# Altium schematic sheet Charging.SchDoc
size A
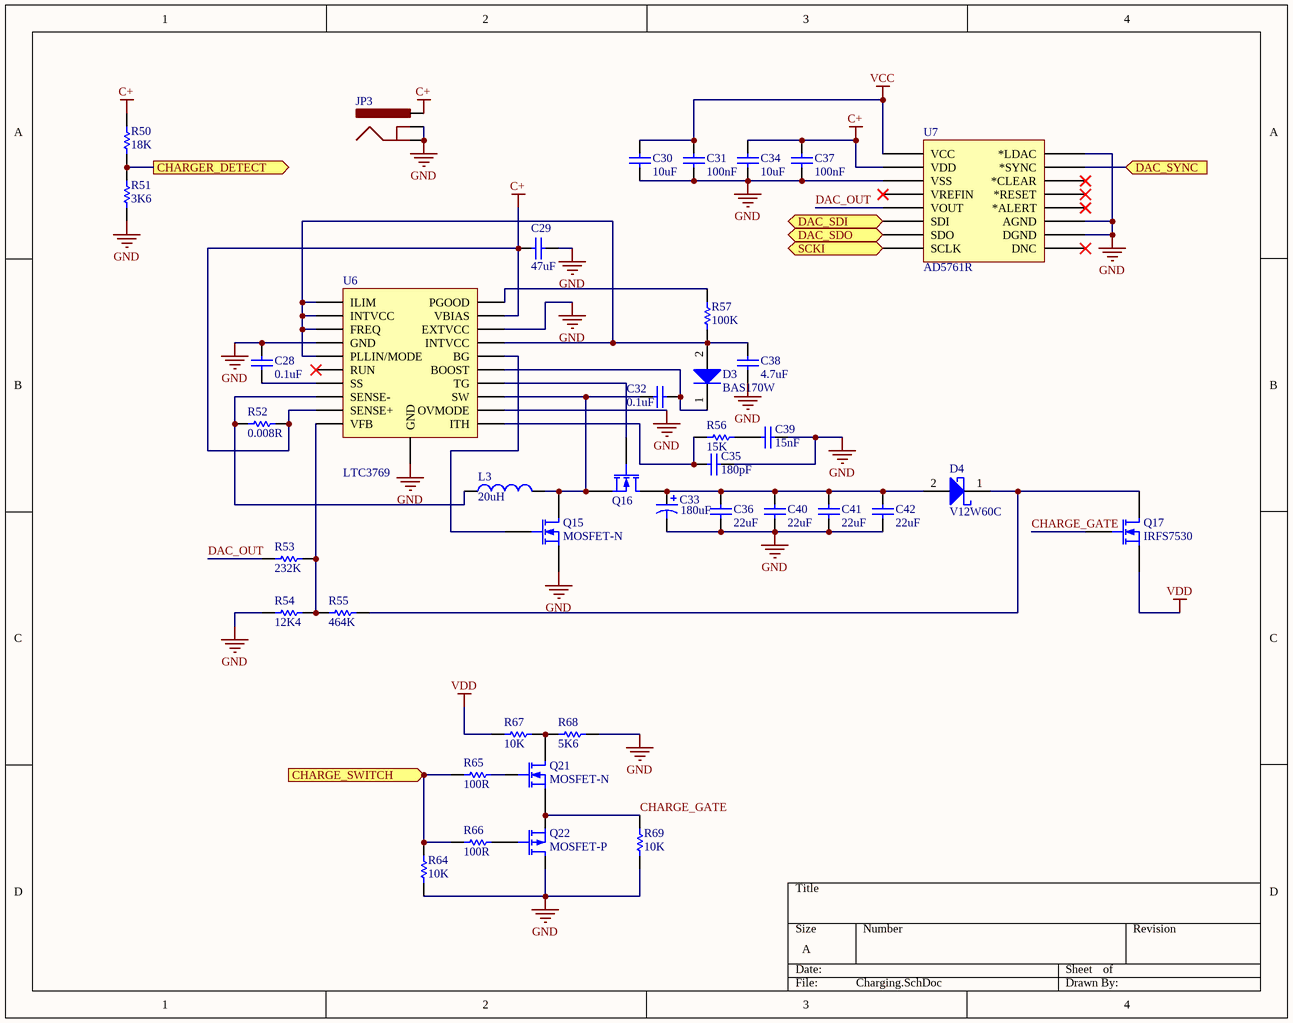
[diagram p0: Charging.SchDoc]

## Parts
C28  0.1uF  [CAPC0603(1608)100_M]
C29  47uF  [CAPC1206(3216)190_M]
C30  10uF  [CAPC0805(2012)145_N]
C31  100nF  [CAPC0603(1608)100_N]
C32  0.1uF  [CAPC0603(1608)100_M]
C33  value 180uF  [CAP 180uF 50V]
C34  10uF  [CAPC0805(2012)145_N]
C35  180pF  [CAPC0603(1608)100_M]
C36  22uF  [CAPC2220(5750)230_N]
C37  100nF  [CAPC0603(1608)100_N]
C38  4.7uF  [CAPC0603(1608)55_M]
C39  15nF  [CAPC0603(1608)100_L]
C40  22uF  [CAPC2220(5750)230_N]
C41  22uF  [CAPC2220(5750)230_N]
C42  22uF  [CAPC2220(5750)230_N]
D3  BAS170W  [INF-SOD323_V]
D4  V12W60C  [DPAK229P1003X238-3N]
JP3  (no value)  [POWER_JACK_SMD_OVERPASTE_REDBOARD_0603]
L3  value 20uH  [Inductor_LR]
Q15  MOSFET-N  [SOIC127P600X175-8N]
Q16  (no value)  [SOIC127P600X175-8N]
Q17  IRFS7530  [DPAK127P1525X483-7N]
Q21  MOSFET-N  [SOT23-3]
Q22  MOSFET-P  [SOT23-3]
R50  18K  [RESC0603(1608)_M]
R51  3K6  [RESC0603(1608)_L]
R52  0.008R  [RESC2010(5025)_L]
R53  232K  [RESC0603(1608)_N]
R54  12K4  [RESC0603(1608)_M]
R55  464K  [RESC0603(1608)_M]
R56  15K  [RESC0603(1608)_M]
R57  100K  [RESC0603(1608)_N]
R64  10K  [RESC0603(1608)_N]
R65  100R  [RESC0603(1608)_L]
R66  100R  [RESC0603(1608)_L]
R67  10K  [RESC0603(1608)_N]
R68  5K6  [RESC0603(1608)_M]
R69  10K  [RESC0603(1608)_N]
U6  LTC3769  [TSOP65P640X120_HS-21N]
U7  AD5761R  [RU_16]

## Ports
CHARGE_SWITCH (in), CHARGER_DETECT (out), DAC_SDI (in), DAC_SDO (out), DAC_SYNC (in), SCKI (in)

## Nets
C+: C29.1 C34.2 C37.2 JP3.VIN0(PWR) R50.2 R52.2 U6.9(SENSE+) U6.19(VBIAS) U7.8(VDD)
GND: C28.2 C29.2 C30.1 C31.1 C33.2 C34.1 C35.2 C36.1 C37.1 C38.1 C39.2 C40.1 C41.1 C42.1 JP3.GND(GNDBREAK) JP3.P$4(GND) Q15.3(S) Q22.2(D) R51.1 R54.1 R64.1 R68.1 R69.1 U6.4(GND) U6.12(OVMODE) U6.18(EXTVCC) U6.21(GND) U7.5(AGND) U7.6(VSS) U7.11(*LDAC) U7.16(DGND)
VCC: C30.2 C31.2 U7.15(VCC)
VDD: Q17.3(S) R67.2
CHARGE_GATE: Q17.2(G) Q21.3(S) Q22.3(S) R69.2
CHARGE_SWITCH: R64.2 R65.1 R66.1 ; port CHARGE_SWITCH
CHARGER_DETECT: R50.1 R51.2 ; port CHARGER_DETECT
DAC_OUT: R53.1 U7.7(VOUT)
DAC_SDI: U7.12(SDI) ; port DAC_SDI
DAC_SDO: U7.10(SDO) ; port DAC_SDO
DAC_SYNC: U7.13(*SYNC) ; port DAC_SYNC
SCKI: U7.14(SCLK) ; port SCKI
NetC28_1: C28.1 U6.7(SS)
NetC32_1: C32.1 L3.2 Q15.2(D) Q16.3(S) U6.13(SW)
NetC32_2: C32.2 D3.1(K) U6.15(BOOST)
NetC33_1: C33.1 C36.2 C40.2 C41.2 C42.2 D4.2(A) Q16.2(D)
NetC35_1: C35.1 R56.1 U6.11(ITH)
NetC38_2: C38.2 D3.2(A) R57.1 U6.1(ILIM) U6.2(INTVCC) U6.3(FREQ) U6.5(PLLIN/MODE) U6.17(INTVCC)
NetC39_1: C39.1 R56.2
NetD4_1: D4.1(K) Q17.1(D) R55.2
NetL3_1: L3.1 R52.1 U6.8(SENSE-)
NetQ15_1: Q15.1(G) U6.16(BG)
NetQ16_1: Q16.1(G) U6.14(TG)
NetQ21_1: Q21.1(G) R65.2
NetQ21_2: Q21.2(D) R67.1 R68.2
NetQ22_1: Q22.1(G) R66.2
NetR53_2: R53.2 R54.2 R55.1 U6.10(VFB)
NetR57_2: R57.2 U6.20(PGOOD)

Not connected (* = marked no-connect by the designer): U6 6(RUN)*; U7 1(*ALERT)* 2(*CLEAR)* 3(*RESET)* 4(VREFIN)* 9(DNC)*

## Library data of the parts
C28 C32 = CMP-1035-02575-1: CAP 100nF 6.3V Â±5% 0603 (1608 Metric) Thickness 1mm SMD; Case-Metric: 1608; Case-EIA: 0603; Tolerance: Â±5%; Technology: SMT; Rated Voltage: 6.3 V; Max Thickness: 1 mm; Value: 100nF
C29 = CMP-1037-04995-1: CAP 22uF 25V Â±20% 1206 (3216 Metric) Thickness 1.9mm SMD; Case-EIA: 1206; Case-Metric: 3216; Tolerance: Â±20%; Rated Voltage: 25 V; Technology: SMT; Max Thickness: 1.9 mm; Value: 22uF
C30 C34 = CMP-1036-04932-1: CAP 10uF 25V Â±10% 0805 (2012 Metric) Thickness 1.45mm SMD; Case-EIA: 0805; Case-Metric: 2012; Technology: SMT; Value: 10uF; Rated Voltage: 25 V; Max Thickness: 1.45 mm; Tolerance: Â±10%
C31 C37 = CMP-1035-02587-1: CAP 100nF 25V Â±5% 0603 (1608 Metric) Thickness 1mm SMD; Case-EIA: 0603; Case-Metric: 1608; Technology: SMT; Tolerance: Â±5%; Max Thickness: 1 mm; Rated Voltage: 25 V; Value: 100nF
C33 = CAP 180uF 50V: Polarized Capacitor (Axial); Published: 8-Jun-2000; LatestRevisionDate: 17-Jul-2002; LatestRevisionNote: Re-released for DXP Platform.; PackageReference: POLAR0.8; Publisher: Altium Limited; PackageDescription: Polarized Capacitor; 2 Leads
C35 = CMP-1035-01398-1: CAP 180pF 6.3V Â±5% 0603 (1608 Metric) Thickness 1mm SMD; Case-Metric: 1608; Case-EIA: 0603; Tolerance: Â±5%; Technology: SMT; Max Thickness: 1 mm; Rated Voltage: 6.3 V; Value: 180pF
C36 C40-C42 = CMP-1042-00782-1: CAP 22uF 50V -20% to +80% 2220 (5750 Metric) Thickness 2.2mm SMD; Case-EIA: 2220; Case-Metric: 5750; Max Thickness: 2.2 mm; Tolerance: -20% to +80%; Technology: SMT; Rated Voltage: 50 V; Value: 22uF
C38 = CMP-1035-02779-1: CAP 4.7uF 6.3V Â±10% 0603 (1608 Metric) Thickness 0.55mm SMD; Case-EIA: 0603; Case-Metric: 1608; Technology: SMT; Tolerance: Â±10%; Value: 4.7uF; Max Thickness: 0.55 mm; Rated Voltage: 6.3 V
C39 = CMP-1035-02358-1: CAP 15nF 6.3V Â±5% 0603 (1608 Metric) Thickness 1mm SMD; Case-Metric: 1608; Case-EIA: 0603; Rated Voltage: 6.3 V; Value: 15nF; Tolerance: Â±5%; Technology: SMT; Max Thickness: 1 mm
D3 = CMP-1182-00005-1: Silicon Schottky Diode, -55 to 125 degC, SOD323, Reel, Green; Manufacturer: Infineon; Green: TRUE; VF (max): 1,000Â mV; VR (max): 70Â V; Configuration: Single; CT (max): 2Â pF; IF (max): 70Â mA; PackageReference: SOD323; PartNumber: BAS170W; ComponentLink3URL: http://www.infineon.com/dgdl/SOD323-Package_Overview.pdf?folderId=db3a30431936bc4b011952aab84f3bbe&fileId=db3a30431936bc4b011952beed653be3; PackageDescription: 2-Pin Small Outline Diode Package, 1.25 x 1.7 mm Body; ComponentLink2URL: http://www.infineon.com/dgdl/bas70_bas170series.pdf?folderId=db3a30431400ef68011425f1ca2505e3&fileId=db3a304314dca389011518ad41680e12; ComponentLink3Description: Package Specification; ComponentLink1URL: http://www.infineon.com/; ComponentLink1Description: Manufacturer URL; Packing: Reel; ComponentLink2Description: Datasheet; Mounting Technology: Surface Mount
D4 = V12W60C: pin to pad: 1>2 2>1
JP3 = POWER_JACK1
L3 = CTX20-7-52LP-R: Inductor; Code_IEC: 1005; Published: 8-Jun-2000; LatestRevisionDate: 29-May-2009; LatestRevisionNote: IPC-7351 Footprint Added.; PackageReference: 0402-A; Publisher: Altium Limited; PackageDescription: Chip Inductor; Code_JEITA: 0402
Q15 Q16 = MOSFET-N: N-Channel MOSFET; pin to pad: 1>2 2>3 3>1; Published: 8-Jun-2000; LatestRevisionDate: 17-Jul-2002; LatestRevisionNote: Re-released for DXP Platform.; PackageVersion: 1995/1996; PackageReference: E3; Publisher: Altium Limited; PackageDescription: TO, Flat Index; 3 In-Line, Axial Leads; Body Dia. 4.6mm; Lead Dia. 0.5 mm (max)
Q17 = IRFS7530: N-Channel MOSFET; pin to pad: 1>8 2>1 3>2+3+5+6+7; Published: 8-Jun-2000; LatestRevisionDate: 17-Jul-2002; LatestRevisionNote: Re-released for DXP Platform.; PackageVersion: 1995/1996; PackageReference: E3; Publisher: Altium Limited; PackageDescription: TO, Flat Index; 3 In-Line, Axial Leads; Body Dia. 4.6mm; Lead Dia. 0.5 mm (max)
Q21 = MOSFET-N: N-Channel MOSFET; Published: 8-Jun-2000; LatestRevisionDate: 17-Jul-2002; LatestRevisionNote: Re-released for DXP Platform.; PackageVersion: 1995/1996; PackageReference: E3; Publisher: Altium Limited; PackageDescription: TO, Flat Index; 3 In-Line, Axial Leads; Body Dia. 4.6mm; Lead Dia. 0.5 mm (max)
Q22 = MOSFET-P: P-Channel MOSFET; Published: 8-Jun-2000; LatestRevisionDate: 17-Jul-2002; LatestRevisionNote: Re-released for DXP Platform.; PackageVersion: 1995/1996; PackageReference: E3; Publisher: Altium Limited; PackageDescription: TO, Flat Index; 3 In-Line, Axial Leads; Body Dia. 4.6mm; Lead Dia. 0.5 mm (max)
R50 = CMP-1012-00650-1: 18K 0.1W 1% 0603 (1608 Metric)  SMD; Value: 18000.00 Ohm; Case-EIA: 0603; Case-Metric: 1608; Power: 0.1 W; Tolerance: 1 %; Technology: SMT
R51 = CMP-1012-00572-1: 3K6 0.1W 1% 0603 (1608 Metric)  SMD; Case-Metric: 1608; Value: 3600.00 Ohm; Case-EIA: 0603; Tolerance: 1 %; Technology: SMT; Power: 0.1 W
R52 = CMP-1017-00002-1: 1R 0.75W 5% 2010 (5025 Metric)  SMD; Case-Metric: 5025; Case-EIA: 2010; Value: 1.00 Ohm; Tolerance: 5 %; Technology: SMT; Power: 0.75 W
R53 = CMP-1012-00775-1: 232K 0.1W 1% 0603 (1608 Metric)  SMD; Case-EIA: 0603; Case-Metric: 1608; Value: 232000.00 Ohm; Technology: SMT; Tolerance: 1 %; Power: 0.1 W
R54 = CMP-1012-00633-1: 12K4 0.1W 1% 0603 (1608 Metric)  SMD; Case-EIA: 0603; Value: 12400.00 Ohm; Case-Metric: 1608; Power: 0.1 W; Tolerance: 1 %; Technology: SMT
R55 = CMP-1012-00811-1: 464K 0.1W 1% 0603 (1608 Metric)  SMD; Value: 464000.00 Ohm; Case-Metric: 1608; Case-EIA: 0603; Tolerance: 1 %; Power: 0.1 W; Technology: SMT
R56 = CMP-1012-00102-1: 15K 0.1W 5% 0603 (1608 Metric)  SMD; Value: 15000.00 Ohm; Case-Metric: 1608; Case-EIA: 0603; Power: 0.1 W; Technology: SMT; Tolerance: 5 %
R57 = CMP-1012-00122-1: 100K 0.1W 5% 0603 (1608 Metric)  SMD; Case-EIA: 0603; Value: 100000.00 Ohm; Case-Metric: 1608; Tolerance: 5 %; Power: 0.1 W; Technology: SMT
R64 R69 = CMP-1012-00623-1: 10K 0.1W 1% 0603 (1608 Metric)  SMD; Value: 10000.00 Ohm; Case-EIA: 0603; Case-Metric: 1608; Power: 0.1 W; Tolerance: 1 %; Technology: SMT
R65 R66 = CMP-1012-00050-1: 100R 0.1W 5% 0603 (1608 Metric)  SMD; Case-EIA: 0603; Value: 100.00 Ohm; Case-Metric: 1608; Tolerance: 5 %; Technology: SMT; Power: 0.1 W
R67 = CMP-1012-00098-1: 10K 0.1W 5% 0603 (1608 Metric)  SMD; Case-EIA: 0603; Value: 10000.00 Ohm; Case-Metric: 1608; Technology: SMT; Tolerance: 5 %; Power: 0.1 W
R68 = CMP-1012-00595-1: 5K6 0.1W 1% 0603 (1608 Metric)  SMD; Value: 5600.00 Ohm; Case-Metric: 1608; Case-EIA: 0603; Tolerance: 1 %; Power: 0.1 W; Technology: SMT
U6 = LTC3769: pin to pad: 2>2+17 4>4+21 17>2+17 21>4+21
U7 = AD5761BRUZ: Imported; RefDes: RefDes; Type: DEV; Value: Value